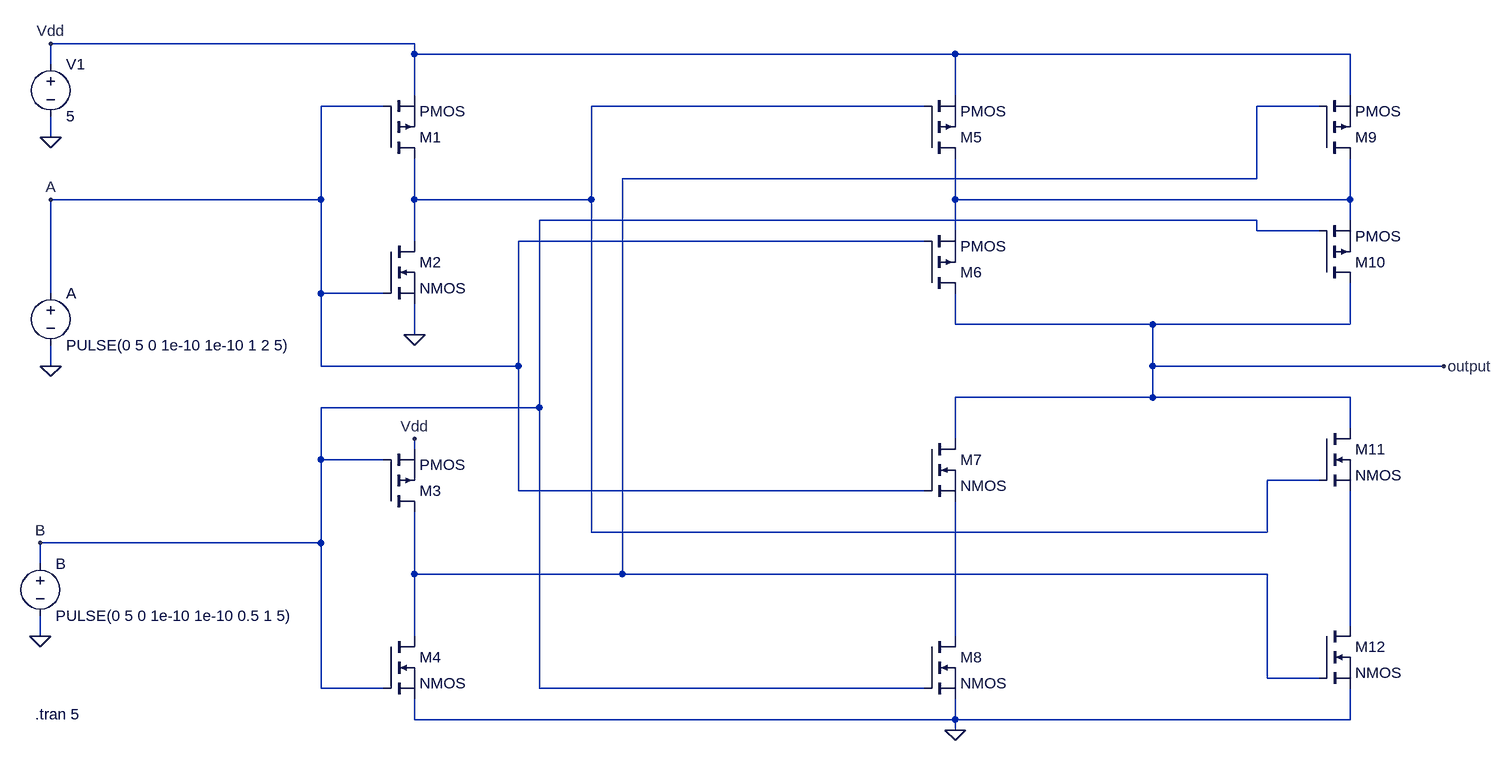
[diagram p0: schematic XOR_schematic.asc]
XOR_schematic.asc, the LTspice schematic file:
Version 4
SHEET 1 1648 1044
WIRE -32 -32 -592 -32
WIRE -32 -16 -32 -32
WIRE 800 -16 -32 -16
WIRE 1408 -16 800 -16
WIRE -592 0 -592 -32
WIRE -32 48 -32 -16
WIRE 800 48 800 -16
WIRE 1408 48 1408 -16
WIRE -80 64 -176 64
WIRE 752 64 240 64
WIRE 1360 64 1264 64
WIRE -592 112 -592 80
WIRE 1264 176 1264 64
WIRE 1264 176 288 176
WIRE -176 208 -176 64
WIRE -176 208 -592 208
WIRE -32 208 -32 144
WIRE 240 208 240 64
WIRE 240 208 -32 208
WIRE 800 208 800 144
WIRE 1408 208 1408 144
WIRE 1408 208 800 208
WIRE 1264 240 160 240
WIRE 1408 240 1408 208
WIRE 800 256 800 208
WIRE 1264 256 1264 240
WIRE 1360 256 1264 256
WIRE -32 272 -32 208
WIRE 752 272 128 272
WIRE -592 352 -592 208
WIRE -176 352 -176 208
WIRE -80 352 -176 352
WIRE 800 400 800 352
WIRE 1104 400 800 400
WIRE 1408 400 1408 336
WIRE 1408 400 1104 400
WIRE -32 416 -32 368
WIRE -592 464 -592 432
WIRE -176 464 -176 352
WIRE 128 464 128 272
WIRE 128 464 -176 464
WIRE 1104 464 1104 400
WIRE 1552 464 1104 464
WIRE 1104 512 1104 464
WIRE 1104 512 800 512
WIRE 1408 512 1104 512
WIRE 160 528 160 240
WIRE 160 528 -176 528
WIRE 1408 560 1408 512
WIRE 800 576 800 512
WIRE -32 592 -32 576
WIRE -176 608 -176 528
WIRE -80 608 -176 608
WIRE 1360 640 1280 640
WIRE 128 656 128 464
WIRE 752 656 128 656
WIRE 240 720 240 208
WIRE 1280 720 1280 640
WIRE 1280 720 240 720
WIRE -176 736 -176 608
WIRE -176 736 -608 736
WIRE -608 768 -608 736
WIRE -32 784 -32 688
WIRE 288 784 288 176
WIRE 288 784 -32 784
WIRE 1280 784 288 784
WIRE 1408 864 1408 656
WIRE -608 880 -608 848
WIRE -32 880 -32 784
WIRE 800 880 800 672
WIRE 1280 944 1280 784
WIRE 1360 944 1280 944
WIRE -176 960 -176 736
WIRE -80 960 -176 960
WIRE 160 960 160 528
WIRE 752 960 160 960
WIRE -32 1008 -32 976
WIRE 800 1008 800 976
WIRE 800 1008 -32 1008
WIRE 1408 1008 1408 960
WIRE 1408 1008 800 1008
WIRE 800 1024 800 1008
FLAG -32 416 0
FLAG -32 576 Vdd
FLAG 800 1024 0
FLAG -592 112 0
FLAG -592 464 0
FLAG -608 880 0
FLAG -592 -32 Vdd
FLAG -592 208 A
FLAG -608 736 B
FLAG 1552 464 output
SYMBOL pmos -80 144 M180
SYMATTR InstName M1
SYMBOL nmos -80 272 R0
SYMATTR InstName M2
SYMBOL pmos -80 688 M180
SYMATTR InstName M3
SYMBOL nmos -80 880 R0
SYMATTR InstName M4
SYMBOL pmos 752 144 M180
SYMATTR InstName M5
SYMBOL pmos 752 352 M180
SYMATTR InstName M6
SYMBOL nmos 752 576 R0
SYMATTR InstName M7
SYMBOL nmos 752 880 R0
SYMATTR InstName M8
SYMBOL pmos 1360 144 M180
SYMATTR InstName M9
SYMBOL pmos 1360 336 M180
SYMATTR InstName M10
SYMBOL nmos 1360 560 R0
SYMATTR InstName M11
SYMBOL nmos 1360 864 R0
SYMATTR InstName M12
SYMBOL voltage -592 -16 R0
WINDOW 123 0 0 Left 0
WINDOW 39 0 0 Left 0
SYMATTR InstName V1
SYMATTR Value 5
SYMBOL voltage -592 336 R0
WINDOW 123 0 0 Left 0
WINDOW 39 0 0 Left 0
SYMATTR InstName A
SYMATTR Value PULSE(0 5 0 1e-10 1e-10 1 2 5)
SYMBOL voltage -608 752 R0
WINDOW 123 0 0 Left 0
WINDOW 39 0 0 Left 0
SYMATTR InstName B
SYMATTR Value PULSE(0 5 0 1e-10 1e-10 0.5 1 5)
TEXT -616 1000 Left 2 !.tran 5

The netlist it stands for:
* XOR_schematic.asc
M1 N001 A Vdd Vdd PMOS
M2 N001 A 0 0 NMOS
M3 N002 B Vdd Vdd PMOS
M4 N002 B 0 0 NMOS
M5 N003 N001 Vdd Vdd PMOS
M6 output A N003 N003 PMOS
M7 output A N005 N005 NMOS
M8 N005 B 0 0 NMOS
M9 N003 N002 Vdd Vdd PMOS
M10 output B N003 N003 PMOS
M11 output N001 N004 N004 NMOS
M12 N004 N002 0 0 NMOS
V1 Vdd 0 5
V§A A 0 PULSE(0 5 0 1e-10 1e-10 1 2 5)
V§B B 0 PULSE(0 5 0 1e-10 1e-10 0.5 1 5)
.model NMOS NMOS
.model PMOS PMOS
.lib standard.mos
.tran 5
.backanno
.end